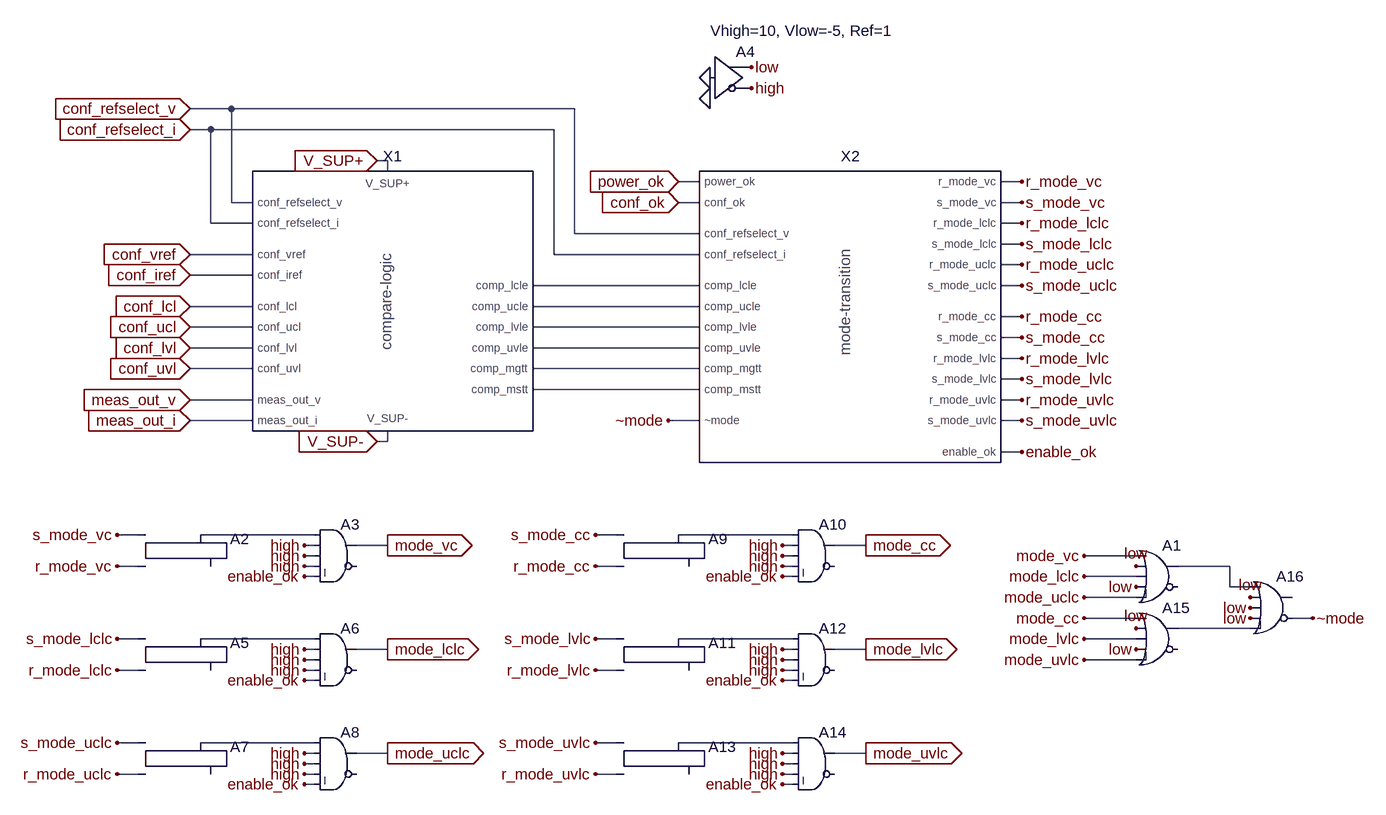
[diagram p0: schematic limit-logic.asc]
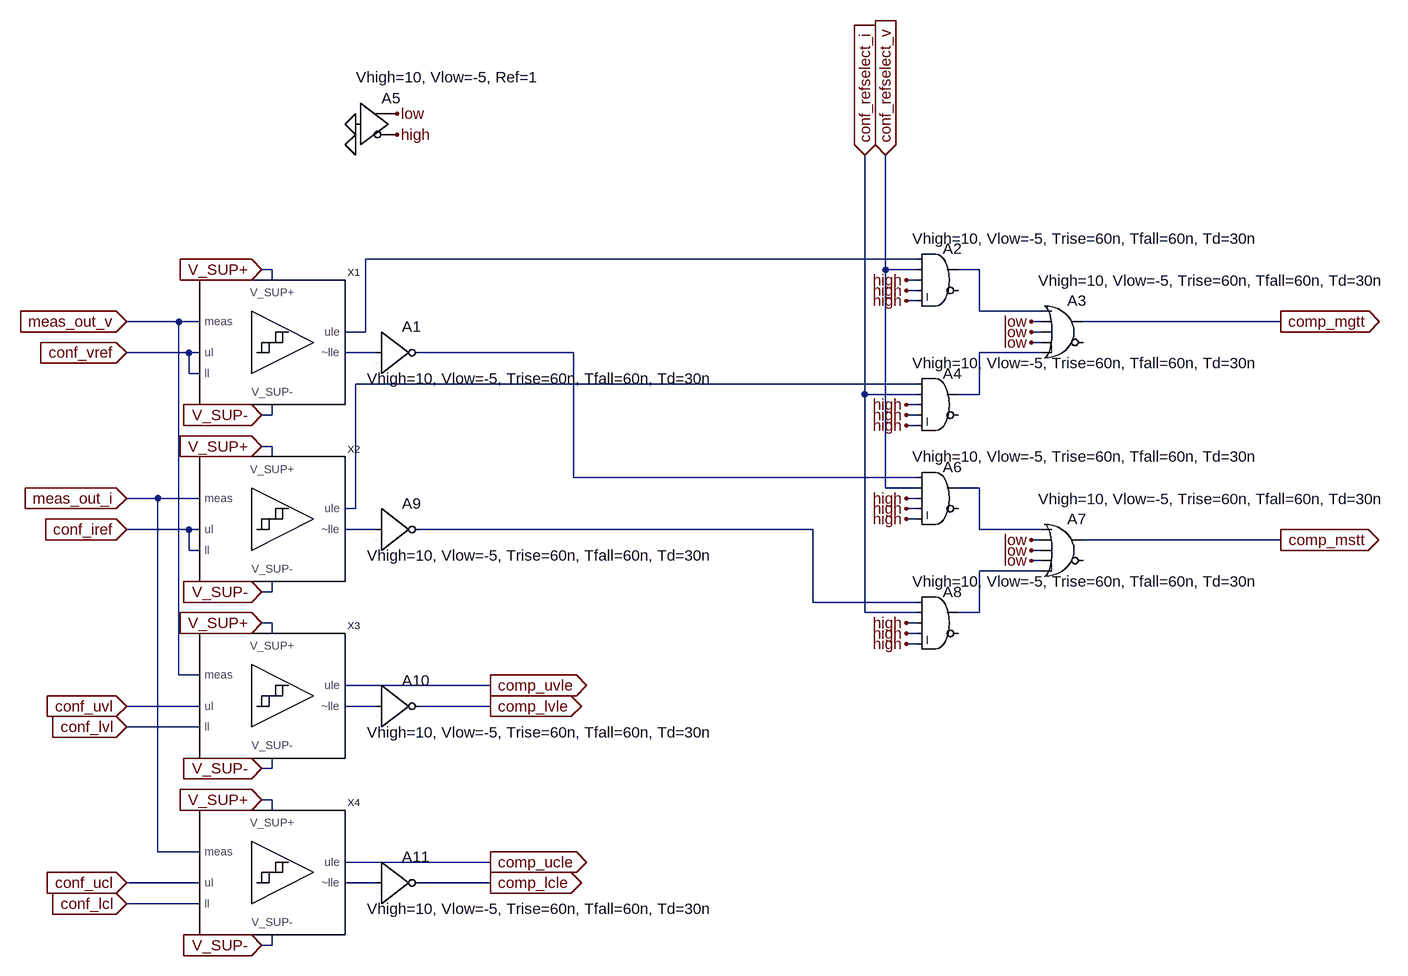
[diagram p1: sub-circuit compare-logic.asc]
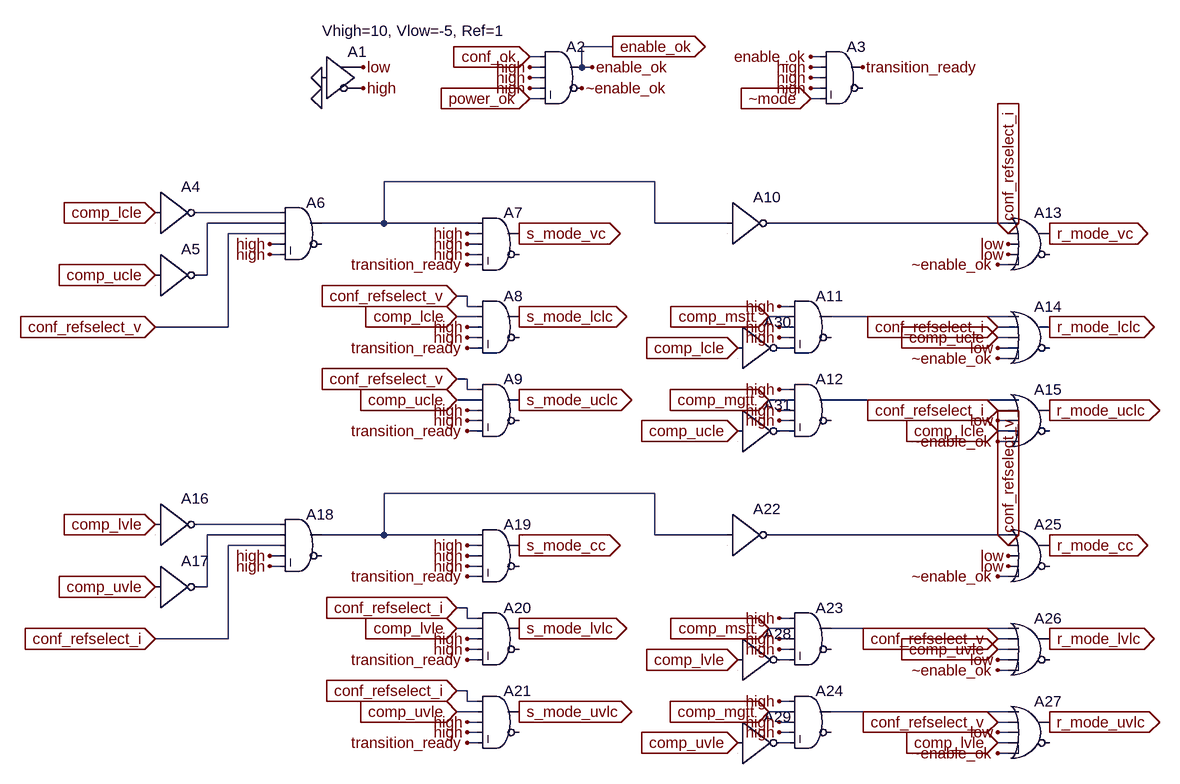
[diagram p2: sub-circuit mode-transition.asc]
limit-logic.asc, the LTspice schematic file:
Version 4
SHEET 1 2188 924
WIRE -176 -208 -240 -208
WIRE 352 -208 -176 -208
WIRE -208 -176 -240 -176
WIRE 320 -176 -208 -176
WIRE 64 -128 48 -128
WIRE 64 -112 64 -128
WIRE 544 -96 512 -96
WIRE 1040 -96 1008 -96
WIRE -176 -64 -176 -208
WIRE -144 -64 -176 -64
WIRE 544 -64 512 -64
WIRE 1040 -64 1008 -64
WIRE -208 -32 -208 -176
WIRE -144 -32 -208 -32
WIRE 1040 -32 1008 -32
WIRE 352 -16 352 -208
WIRE 544 -16 352 -16
WIRE 1040 0 1008 0
WIRE -144 16 -240 16
WIRE 320 16 320 -176
WIRE 544 16 320 16
WIRE 1040 32 1008 32
WIRE -144 48 -240 48
WIRE 544 64 288 64
WIRE 1040 64 1008 64
WIRE -144 96 -240 96
WIRE 544 96 288 96
WIRE 1040 112 1008 112
WIRE -144 128 -240 128
WIRE 544 128 288 128
WIRE 1040 144 1008 144
WIRE -144 160 -240 160
WIRE 544 160 288 160
WIRE 1040 176 1008 176
WIRE -144 192 -240 192
WIRE 544 192 288 192
WIRE 1040 208 1008 208
WIRE 544 224 288 224
WIRE -144 240 -240 240
WIRE 1040 240 1008 240
WIRE -144 272 -240 272
WIRE 544 272 496 272
WIRE 1040 272 1008 272
WIRE 64 304 64 288
WIRE 64 304 48 304
WIRE 1040 320 1008 320
WIRE -320 448 -352 448
WIRE -48 448 -224 448
WIRE 416 448 384 448
WIRE 688 448 512 448
WIRE -48 464 -64 464
WIRE 64 464 16 464
WIRE 688 464 672 464
WIRE 800 464 752 464
WIRE -48 480 -64 480
WIRE 688 480 672 480
WIRE 1216 480 1136 480
WIRE -320 496 -352 496
WIRE -48 496 -64 496
WIRE 416 496 384 496
WIRE 688 496 672 496
WIRE 1360 496 1280 496
WIRE -48 512 -64 512
WIRE 688 512 672 512
WIRE 1216 512 1136 512
WIRE 1360 528 1360 496
WIRE 1392 528 1360 528
WIRE 1216 544 1136 544
WIRE 1216 576 1136 576
WIRE 1488 576 1456 576
WIRE 1392 592 1280 592
WIRE -320 608 -352 608
WIRE -48 608 -224 608
WIRE 416 608 384 608
WIRE 688 608 512 608
WIRE 1216 608 1136 608
WIRE -48 624 -64 624
WIRE 64 624 16 624
WIRE 688 624 672 624
WIRE 800 624 752 624
WIRE -48 640 -64 640
WIRE 688 640 672 640
WIRE 1216 640 1136 640
WIRE -320 656 -352 656
WIRE -48 656 -64 656
WIRE 416 656 384 656
WIRE 688 656 672 656
WIRE -48 672 -64 672
WIRE 688 672 672 672
WIRE -320 768 -352 768
WIRE -48 768 -224 768
WIRE 416 768 384 768
WIRE 688 768 512 768
WIRE -48 784 -64 784
WIRE 64 784 16 784
WIRE 688 784 672 784
WIRE 800 784 752 784
WIRE -48 800 -64 800
WIRE 688 800 672 800
WIRE -320 816 -352 816
WIRE -48 816 -64 816
WIRE 416 816 384 816
WIRE 688 816 672 816
WIRE -48 832 -64 832
WIRE 688 832 672 832
FLAG -240 240 meas_out_v
IOPIN -240 240 In
FLAG -240 272 meas_out_i
IOPIN -240 272 In
FLAG -240 16 conf_vref
IOPIN -240 16 In
FLAG -240 48 conf_iref
IOPIN -240 48 In
FLAG -240 192 conf_uvl
IOPIN -240 192 In
FLAG -240 160 conf_lvl
IOPIN -240 160 In
FLAG -240 128 conf_ucl
IOPIN -240 128 In
FLAG -240 96 conf_lcl
IOPIN -240 96 In
FLAG -240 -208 conf_refselect_v
IOPIN -240 -208 In
FLAG -240 -176 conf_refselect_i
IOPIN -240 -176 In
FLAG 512 -64 conf_ok
IOPIN 512 -64 In
FLAG 512 -96 power_ok
IOPIN 512 -96 In
FLAG 1040 -96 r_mode_vc
FLAG 1040 -32 r_mode_lclc
FLAG 1040 32 r_mode_uclc
FLAG 1040 112 r_mode_cc
FLAG 1040 176 r_mode_lvlc
FLAG 1040 240 r_mode_uvlc
FLAG 1040 -64 s_mode_vc
FLAG 1040 0 s_mode_lclc
FLAG 1040 64 s_mode_uclc
FLAG 1040 144 s_mode_cc
FLAG 1040 208 s_mode_lvlc
FLAG 1040 272 s_mode_uvlc
FLAG -352 496 r_mode_vc
FLAG -352 656 r_mode_lclc
FLAG -352 816 r_mode_uclc
FLAG 384 496 r_mode_cc
FLAG 384 656 r_mode_lvlc
FLAG 384 816 r_mode_uvlc
FLAG -352 448 s_mode_vc
FLAG -352 608 s_mode_lclc
FLAG -352 768 s_mode_uclc
FLAG 384 448 s_mode_cc
FLAG 384 608 s_mode_lvlc
FLAG 384 768 s_mode_uvlc
FLAG 1040 320 enable_ok
FLAG 560 -224 0
FLAG 560 -256 0
FLAG 624 -240 high
FLAG 624 -272 low
FLAG -64 464 high
FLAG -64 480 high
FLAG -64 496 high
FLAG -64 512 enable_ok
FLAG 64 464 mode_vc
IOPIN 64 464 Out
FLAG -64 624 high
FLAG -64 640 high
FLAG -64 656 high
FLAG -64 672 enable_ok
FLAG 64 624 mode_lclc
IOPIN 64 624 Out
FLAG -64 784 high
FLAG -64 800 high
FLAG -64 816 high
FLAG -64 832 enable_ok
FLAG 64 784 mode_uclc
IOPIN 64 784 Out
FLAG 672 464 high
FLAG 672 480 high
FLAG 672 496 high
FLAG 672 512 enable_ok
FLAG 800 464 mode_cc
IOPIN 800 464 Out
FLAG 672 624 high
FLAG 672 640 high
FLAG 672 656 high
FLAG 672 672 enable_ok
FLAG 800 624 mode_lvlc
IOPIN 800 624 Out
FLAG 672 784 high
FLAG 672 800 high
FLAG 672 816 high
FLAG 672 832 enable_ok
FLAG 800 784 mode_uvlc
IOPIN 800 784 Out
FLAG 1136 480 mode_vc
FLAG 1136 512 mode_lclc
FLAG 1136 544 mode_uclc
FLAG 1136 576 mode_cc
FLAG 1136 608 mode_lvlc
FLAG 1136 640 mode_uvlc
FLAG 1216 496 low
FLAG 1216 528 low
FLAG 1216 592 low
FLAG 1216 624 low
FLAG 1392 544 low
FLAG 1392 560 low
FLAG 1392 576 low
FLAG 1488 576 ~mode
FLAG 496 272 ~mode
FLAG 48 -128 V_SUP+
IOPIN 48 -128 In
FLAG 48 304 V_SUP-
IOPIN 48 304 In
SYMBOL compare-logic 64 80 R0
SYMATTR InstName X1
SYMBOL mode-transition 768 80 R0
SYMATTR InstName X2
SYMBOL Digital\\or 1248 448 R0
SYMATTR SpiceLine Vhigh=10, Vlow=-5, Trise=60n, Tfall=60n, Td=30n
SYMATTR InstName A1
SYMBOL Digital\\srflop -272 400 R0
SYMATTR InstName A2
SYMATTR SpiceLine Vhigh=10, Vlow=-5, Trise=60n, Tfall=60n, Td=30n
SYMBOL Digital\\and -16 416 R0
SYMATTR SpiceLine Vhigh=10, Vlow=-5, Trise=60n, Tfall=60n, Td=30n
SYMATTR InstName A3
SYMBOL Digital\\buf 560 -320 R0
WINDOW 39 1 -8 Left 2
SYMATTR SpiceLine Vhigh=10, Vlow=-5, Ref=1
SYMATTR InstName A4
SYMBOL Digital\\srflop -272 560 R0
SYMATTR InstName A5
SYMATTR SpiceLine Vhigh=10, Vlow=-5, Trise=60n, Tfall=60n, Td=30n
SYMBOL Digital\\and -16 576 R0
SYMATTR SpiceLine Vhigh=10, Vlow=-5, Trise=60n, Tfall=60n, Td=30n
SYMATTR InstName A6
SYMBOL Digital\\srflop -272 720 R0
SYMATTR InstName A7
SYMATTR SpiceLine Vhigh=10, Vlow=-5, Trise=60n, Tfall=60n, Td=30n
SYMBOL Digital\\and -16 736 R0
SYMATTR SpiceLine Vhigh=10, Vlow=-5, Trise=60n, Tfall=60n, Td=30n
SYMATTR InstName A8
SYMBOL Digital\\srflop 464 400 R0
SYMATTR InstName A9
SYMATTR SpiceLine Vhigh=10, Vlow=-5, Trise=60n, Tfall=60n, Td=30n
SYMBOL Digital\\and 720 416 R0
SYMATTR SpiceLine Vhigh=10, Vlow=-5, Trise=60n, Tfall=60n, Td=30n
SYMATTR InstName A10
SYMBOL Digital\\srflop 464 560 R0
SYMATTR InstName A11
SYMATTR SpiceLine Vhigh=10, Vlow=-5, Trise=60n, Tfall=60n, Td=30n
SYMBOL Digital\\and 720 576 R0
SYMATTR SpiceLine Vhigh=10, Vlow=-5, Trise=60n, Tfall=60n, Td=30n
SYMATTR InstName A12
SYMBOL Digital\\srflop 464 720 R0
SYMATTR InstName A13
SYMATTR SpiceLine Vhigh=10, Vlow=-5, Trise=60n, Tfall=60n, Td=30n
SYMBOL Digital\\and 720 736 R0
SYMATTR SpiceLine Vhigh=10, Vlow=-5, Trise=60n, Tfall=60n, Td=30n
SYMATTR InstName A14
SYMBOL Digital\\or 1248 544 R0
SYMATTR SpiceLine Vhigh=10, Vlow=-5, Trise=60n, Tfall=60n, Td=30n
SYMATTR InstName A15
SYMBOL Digital\\or 1424 496 R0
SYMATTR SpiceLine Vhigh=10, Vlow=-5, Trise=60n, Tfall=60n, Td=30n
SYMATTR InstName A16

compare-logic.asc, the sub-circuit schematic file:
Version 4
SHEET 1 1856 856
WIRE 960 -272 112 -272
WIRE -32 -256 -48 -256
WIRE 912 -256 912 -432
WIRE 960 -256 912 -256
WIRE 1056 -256 1024 -256
WIRE -32 -240 -32 -256
WIRE 960 -240 944 -240
WIRE 960 -224 944 -224
WIRE 960 -208 944 -208
WIRE 1056 -192 1056 -256
WIRE 1152 -192 1056 -192
WIRE -176 -176 -256 -176
WIRE -144 -176 -176 -176
WIRE 1152 -176 1136 -176
WIRE 1520 -176 1216 -176
WIRE 112 -160 112 -272
WIRE 112 -160 80 -160
WIRE 1152 -160 1136 -160
WIRE 1152 -144 1136 -144
WIRE -160 -128 -256 -128
WIRE -144 -128 -160 -128
WIRE 128 -128 80 -128
WIRE 432 -128 192 -128
WIRE 1152 -128 1056 -128
WIRE -160 -96 -160 -128
WIRE -144 -96 -160 -96
WIRE 960 -80 96 -80
WIRE 880 -64 880 -432
WIRE 960 -64 880 -64
WIRE 1056 -64 1056 -128
WIRE 1056 -64 1024 -64
WIRE 960 -48 944 -48
WIRE -32 -32 -32 -48
WIRE -32 -32 -48 -32
WIRE 960 -32 944 -32
WIRE 960 -16 944 -16
WIRE -32 16 -48 16
WIRE -32 32 -32 16
WIRE 432 64 432 -128
WIRE 960 64 432 64
WIRE 912 80 912 -256
WIRE 960 80 912 80
WIRE 1056 80 1024 80
WIRE -208 96 -256 96
WIRE -144 96 -208 96
WIRE 960 96 944 96
WIRE 96 112 96 -80
WIRE 96 112 80 112
WIRE 960 112 944 112
WIRE 960 128 944 128
WIRE -160 144 -256 144
WIRE -144 144 -160 144
WIRE 128 144 80 144
WIRE 800 144 192 144
WIRE 1056 144 1056 80
WIRE 1152 144 1056 144
WIRE 1152 160 1136 160
WIRE 1520 160 1216 160
WIRE -160 176 -160 144
WIRE -144 176 -160 176
WIRE 1152 176 1136 176
WIRE 1152 192 1136 192
WIRE 1152 208 1056 208
WIRE -32 240 -32 224
WIRE -32 240 -48 240
WIRE 800 256 800 144
WIRE 960 256 800 256
WIRE 880 272 880 -64
WIRE 960 272 880 272
WIRE 1056 272 1056 208
WIRE 1056 272 1024 272
WIRE -32 288 -48 288
WIRE 960 288 944 288
WIRE -32 304 -32 288
WIRE 960 304 944 304
WIRE 960 320 944 320
WIRE -176 368 -176 -176
WIRE -144 368 -176 368
WIRE 304 384 80 384
WIRE -144 416 -256 416
WIRE 128 416 80 416
WIRE 304 416 192 416
WIRE -144 448 -256 448
WIRE -32 512 -32 496
WIRE -32 512 -48 512
WIRE -32 560 -48 560
WIRE -32 576 -32 560
WIRE -208 640 -208 96
WIRE -144 640 -208 640
WIRE 304 656 80 656
WIRE -144 688 -256 688
WIRE 128 688 80 688
WIRE 304 688 192 688
WIRE -144 720 -256 720
WIRE -32 784 -32 768
WIRE -32 784 -48 784
FLAG 96 -448 0
FLAG 96 -480 0
FLAG 160 -464 high
FLAG 160 -496 low
FLAG 944 -240 high
FLAG 944 -224 high
FLAG 944 -208 high
FLAG 1136 -160 low
FLAG 1136 -144 low
FLAG 1136 -176 low
FLAG 944 -48 high
FLAG 944 -32 high
FLAG 944 -16 high
FLAG 912 -432 conf_refselect_v
IOPIN 912 -432 In
FLAG 880 -432 conf_refselect_i
IOPIN 880 -432 In
FLAG 944 96 high
FLAG 944 112 high
FLAG 944 128 high
FLAG 1136 176 low
FLAG 1136 192 low
FLAG 1136 160 low
FLAG 944 288 high
FLAG 944 304 high
FLAG 944 320 high
FLAG -48 -256 V_SUP+
IOPIN -48 -256 In
FLAG -48 -32 V_SUP-
IOPIN -48 -32 In
FLAG -48 16 V_SUP+
IOPIN -48 16 In
FLAG -48 240 V_SUP-
IOPIN -48 240 In
FLAG -48 288 V_SUP+
IOPIN -48 288 In
FLAG -48 512 V_SUP-
IOPIN -48 512 In
FLAG -48 560 V_SUP+
IOPIN -48 560 In
FLAG -48 784 V_SUP-
IOPIN -48 784 In
FLAG 1520 -176 comp_mgtt
IOPIN 1520 -176 Out
FLAG 1520 160 comp_mstt
IOPIN 1520 160 Out
FLAG 304 384 comp_uvle
IOPIN 304 384 Out
FLAG 304 416 comp_lvle
IOPIN 304 416 Out
FLAG 304 656 comp_ucle
IOPIN 304 656 Out
FLAG 304 688 comp_lcle
IOPIN 304 688 Out
FLAG -256 -176 meas_out_v
IOPIN -256 -176 In
FLAG -256 96 meas_out_i
IOPIN -256 96 In
FLAG -256 -128 conf_vref
IOPIN -256 -128 In
FLAG -256 144 conf_iref
IOPIN -256 144 In
FLAG -256 416 conf_uvl
IOPIN -256 416 In
FLAG -256 448 conf_lvl
IOPIN -256 448 In
FLAG -256 688 conf_ucl
IOPIN -256 688 In
FLAG -256 720 conf_lcl
IOPIN -256 720 In
SYMBOL window-comparator -32 -144 R0
SYMATTR InstName X1
SYMBOL Digital\\inv 128 -192 R0
WINDOW 39 -14 104 Left 2
SYMATTR InstName A1
SYMATTR SpiceLine Vhigh=10, Vlow=-5, Trise=60n, Tfall=60n, Td=30n
SYMBOL Digital\\and 992 -304 R0
WINDOW 39 -39 0 Left 2
SYMATTR InstName A2
SYMATTR SpiceLine Vhigh=10, Vlow=-5, Trise=60n, Tfall=60n, Td=30n
SYMBOL Digital\\or 1184 -224 R0
WINDOW 39 -37 -15 Left 2
SYMATTR InstName A3
SYMATTR SpiceLine Vhigh=10, Vlow=-5, Trise=60n, Tfall=60n, Td=30n
SYMBOL Digital\\buf 96 -544 R0
WINDOW 39 1 -8 Left 2
SYMATTR InstName A5
SYMATTR SpiceLine Vhigh=10, Vlow=-5, Ref=1
SYMBOL Digital\\and 992 -112 R0
WINDOW 39 -39 0 Left 2
SYMATTR InstName A4
SYMATTR SpiceLine Vhigh=10, Vlow=-5, Trise=60n, Tfall=60n, Td=30n
SYMBOL Digital\\and 992 32 R0
WINDOW 39 -39 0 Left 2
SYMATTR InstName A6
SYMATTR SpiceLine Vhigh=10, Vlow=-5, Trise=60n, Tfall=60n, Td=30n
SYMBOL Digital\\or 1184 112 R0
WINDOW 39 -37 -15 Left 2
SYMATTR InstName A7
SYMATTR SpiceLine Vhigh=10, Vlow=-5, Trise=60n, Tfall=60n, Td=30n
SYMBOL Digital\\and 992 224 R0
WINDOW 39 -39 0 Left 2
SYMATTR InstName A8
SYMATTR SpiceLine Vhigh=10, Vlow=-5, Trise=60n, Tfall=60n, Td=30n
SYMBOL window-comparator -32 128 R0
SYMATTR InstName X2
SYMBOL Digital\\inv 128 80 R0
WINDOW 39 -14 104 Left 2
SYMATTR InstName A9
SYMATTR SpiceLine Vhigh=10, Vlow=-5, Trise=60n, Tfall=60n, Td=30n
SYMBOL window-comparator -32 400 R0
SYMATTR InstName X3
SYMBOL Digital\\inv 128 352 R0
WINDOW 39 -14 104 Left 2
SYMATTR InstName A10
SYMATTR SpiceLine Vhigh=10, Vlow=-5, Trise=60n, Tfall=60n, Td=30n
SYMBOL window-comparator -32 672 R0
SYMATTR InstName X4
SYMBOL Digital\\inv 128 624 R0
WINDOW 39 -14 104 Left 2
SYMATTR InstName A11
SYMATTR SpiceLine Vhigh=10, Vlow=-5, Trise=60n, Tfall=60n, Td=30n

mode-transition.asc, the sub-circuit schematic file:
Version 4
SHEET 1 2020 1448
WIRE 688 144 640 144
WIRE 576 160 560 160
WIRE 1008 160 992 160
WIRE 576 176 560 176
WIRE 640 176 640 144
WIRE 656 176 640 176
WIRE 1008 176 992 176
WIRE 576 192 560 192
WIRE 1008 192 992 192
WIRE 576 208 560 208
WIRE 1008 208 992 208
WIRE 576 224 560 224
WIRE 1008 224 992 224
WIRE 752 352 336 352
WIRE 176 400 48 400
WIRE 176 416 64 416
WIRE 336 416 336 352
WIRE 336 416 240 416
WIRE 480 416 336 416
WIRE 752 416 752 352
WIRE 864 416 752 416
WIRE 1296 416 928 416
WIRE 176 432 96 432
WIRE 480 432 464 432
WIRE 176 448 160 448
WIRE 480 448 464 448
WIRE 176 464 160 464
WIRE 480 464 464 464
WIRE 480 480 464 480
WIRE 1296 480 1280 480
WIRE 64 496 64 416
WIRE 64 496 48 496
WIRE 464 528 448 528
WIRE 464 544 464 528
WIRE 480 544 464 544
WIRE 960 544 944 544
WIRE 480 560 448 560
WIRE 960 560 928 560
WIRE 1296 560 1024 560
WIRE 96 576 96 432
WIRE 96 576 -16 576
WIRE 480 576 464 576
WIRE 960 576 944 576
WIRE 1296 576 1280 576
WIRE 480 592 464 592
WIRE 960 592 944 592
WIRE 1296 592 1280 592
WIRE 480 608 464 608
WIRE 960 608 944 608
WIRE 1296 608 1280 608
WIRE 1296 624 1280 624
WIRE 464 656 448 656
WIRE 464 672 464 656
WIRE 480 672 464 672
WIRE 960 672 944 672
WIRE 480 688 448 688
WIRE 960 688 928 688
WIRE 1296 688 1024 688
WIRE 480 704 464 704
WIRE 960 704 944 704
WIRE 1296 704 1280 704
WIRE 480 720 464 720
WIRE 960 720 944 720
WIRE 1296 720 1280 720
WIRE 480 736 464 736
WIRE 960 736 944 736
WIRE 1296 736 1280 736
WIRE 1296 752 1280 752
WIRE 752 832 336 832
WIRE 176 880 48 880
WIRE 176 896 64 896
WIRE 336 896 336 832
WIRE 336 896 240 896
WIRE 480 896 336 896
WIRE 752 896 752 832
WIRE 864 896 752 896
WIRE 1296 896 928 896
WIRE 176 912 96 912
WIRE 480 912 464 912
WIRE 176 928 160 928
WIRE 480 928 464 928
WIRE 176 944 160 944
WIRE 480 944 464 944
WIRE 480 960 464 960
WIRE 1296 960 1280 960
WIRE 64 976 64 896
WIRE 64 976 48 976
WIRE 464 1008 448 1008
WIRE 464 1024 464 1008
WIRE 480 1024 464 1024
WIRE 960 1024 944 1024
WIRE 480 1040 448 1040
WIRE 960 1040 928 1040
WIRE 1296 1040 1024 1040
WIRE 96 1056 96 912
WIRE 96 1056 -16 1056
WIRE 480 1056 464 1056
WIRE 960 1056 944 1056
WIRE 1296 1056 1280 1056
WIRE 480 1072 464 1072
WIRE 960 1072 944 1072
WIRE 1296 1072 1280 1072
WIRE 480 1088 464 1088
WIRE 960 1088 944 1088
WIRE 1296 1088 1280 1088
WIRE 1296 1104 1280 1104
WIRE 464 1136 448 1136
WIRE 464 1152 464 1136
WIRE 480 1152 464 1152
WIRE 960 1152 944 1152
WIRE 480 1168 448 1168
WIRE 960 1168 928 1168
WIRE 1296 1168 1024 1168
WIRE 480 1184 464 1184
WIRE 960 1184 944 1184
WIRE 1296 1184 1280 1184
WIRE 480 1200 464 1200
WIRE 960 1200 944 1200
WIRE 1296 1200 1280 1200
WIRE 480 1216 464 1216
WIRE 960 1216 944 1216
WIRE 1296 1216 1280 1216
WIRE 1296 1232 1280 1232
FLAG 240 224 0
FLAG 240 192 0
FLAG 304 208 high
FLAG 304 176 low
FLAG -16 400 comp_lcle
IOPIN -16 400 In
FLAG -16 496 comp_ucle
IOPIN -16 496 In
FLAG -16 576 conf_refselect_v
IOPIN -16 576 In
FLAG 160 448 high
FLAG 160 464 high
FLAG 464 480 transition_ready
FLAG 464 432 high
FLAG 464 448 high
FLAG 464 464 high
FLAG 464 608 transition_ready
FLAG 464 576 high
FLAG 464 592 high
FLAG 464 736 transition_ready
FLAG 464 704 high
FLAG 464 720 high
FLAG 448 528 conf_refselect_v
IOPIN 448 528 In
FLAG 448 656 conf_refselect_v
IOPIN 448 656 In
FLAG 448 560 comp_lcle
IOPIN 448 560 In
FLAG 448 688 comp_ucle
IOPIN 448 688 In
FLAG 544 432 s_mode_vc
IOPIN 544 432 Out
FLAG 544 560 s_mode_lclc
IOPIN 544 560 Out
FLAG 544 688 s_mode_uclc
IOPIN 544 688 Out
FLAG 928 560 comp_mstt
IOPIN 928 560 In
FLAG 928 688 comp_mgtt
IOPIN 928 688 In
FLAG 944 576 high
FLAG 944 592 high
FLAG 944 704 high
FLAG 944 720 high
FLAG 1280 480 ~enable_ok
FLAG 1280 624 ~enable_ok
FLAG 1280 752 ~enable_ok
FLAG 1296 448 low
FLAG 1296 464 low
FLAG 1280 576 conf_refselect_i
IOPIN 1280 576 In
FLAG 1280 608 low
FLAG 1280 720 low
FLAG 1280 704 conf_refselect_i
IOPIN 1280 704 In
FLAG 1360 432 r_mode_vc
IOPIN 1360 432 Out
FLAG 1360 576 r_mode_lclc
IOPIN 1360 576 Out
FLAG 1360 704 r_mode_uclc
IOPIN 1360 704 Out
FLAG -16 880 comp_lvle
IOPIN -16 880 In
FLAG -16 976 comp_uvle
IOPIN -16 976 In
FLAG -16 1056 conf_refselect_i
IOPIN -16 1056 In
FLAG 160 928 high
FLAG 160 944 high
FLAG 464 960 transition_ready
FLAG 464 912 high
FLAG 464 928 high
FLAG 464 944 high
FLAG 464 1088 transition_ready
FLAG 464 1056 high
FLAG 464 1072 high
FLAG 464 1216 transition_ready
FLAG 464 1184 high
FLAG 464 1200 high
FLAG 448 1008 conf_refselect_i
IOPIN 448 1008 In
FLAG 448 1136 conf_refselect_i
IOPIN 448 1136 In
FLAG 448 1040 comp_lvle
IOPIN 448 1040 In
FLAG 448 1168 comp_uvle
IOPIN 448 1168 In
FLAG 544 912 s_mode_cc
IOPIN 544 912 Out
FLAG 544 1040 s_mode_lvlc
IOPIN 544 1040 Out
FLAG 544 1168 s_mode_uvlc
IOPIN 544 1168 Out
FLAG 928 1040 comp_mstt
IOPIN 928 1040 In
FLAG 928 1168 comp_mgtt
IOPIN 928 1168 In
FLAG 944 1056 high
FLAG 944 1072 high
FLAG 944 1184 high
FLAG 944 1200 high
FLAG 1280 960 ~enable_ok
FLAG 1280 1104 ~enable_ok
FLAG 1280 1232 ~enable_ok
FLAG 1296 928 low
FLAG 1296 944 low
FLAG 1280 1056 conf_refselect_v
IOPIN 1280 1056 In
FLAG 1280 1088 low
FLAG 1280 1200 low
FLAG 1280 1184 conf_refselect_v
IOPIN 1280 1184 In
FLAG 1360 912 r_mode_cc
IOPIN 1360 912 Out
FLAG 1360 1056 r_mode_lvlc
IOPIN 1360 1056 Out
FLAG 1360 1184 r_mode_uvlc
IOPIN 1360 1184 Out
FLAG 560 160 conf_ok
IOPIN 560 160 In
FLAG 560 224 power_ok
IOPIN 560 224 In
FLAG 560 176 high
FLAG 560 192 high
FLAG 560 208 high
FLAG 656 176 enable_ok
FLAG 640 208 ~enable_ok
FLAG 992 160 enable_ok
FLAG 992 224 ~mode
IOPIN 992 224 In
FLAG 992 176 high
FLAG 992 192 high
FLAG 992 208 high
FLAG 1072 176 transition_ready
FLAG 688 144 enable_ok
IOPIN 688 144 Out
FLAG 1296 432 conf_refselect_i
IOPIN 1296 432 In
FLAG 1296 912 conf_refselect_v
IOPIN 1296 912 In
FLAG 1280 592 comp_ucle
IOPIN 1280 592 In
FLAG 1280 736 comp_lcle
IOPIN 1280 736 In
FLAG 1280 1072 comp_uvle
IOPIN 1280 1072 In
FLAG 1280 1216 comp_lvle
IOPIN 1280 1216 In
FLAG 880 1088 comp_lvle
IOPIN 880 1088 In
FLAG 880 1216 comp_uvle
IOPIN 880 1216 In
FLAG 880 608 comp_lcle
IOPIN 880 608 In
FLAG 880 736 comp_ucle
IOPIN 880 736 In
FLAG 944 544 high
FLAG 944 672 high
FLAG 944 1024 high
FLAG 944 1152 high
SYMBOL Digital\\buf 240 128 R0
WINDOW 39 1 -8 Left 2
SYMATTR SpiceLine Vhigh=10, Vlow=-5, Ref=1
SYMATTR InstName A1
SYMBOL Digital\\and 608 128 R0
SYMATTR SpiceLine Vhigh=10, Vlow=-5, Trise=60n, Tfall=60n, Td=30n
SYMATTR InstName A2
SYMBOL Digital\\inv -16 336 R0
SYMATTR SpiceLine Vhigh=10, Vlow=-5, Trise=60n, Tfall=60n, Td=30n
SYMATTR InstName A4
SYMBOL Digital\\inv -16 432 R0
SYMATTR SpiceLine Vhigh=10, Vlow=-5, Trise=60n, Tfall=60n, Td=30n
SYMATTR InstName A5
SYMBOL Digital\\and 208 368 R0
SYMATTR SpiceLine Vhigh=10, Vlow=-5, Trise=60n, Tfall=60n, Td=30n
SYMATTR InstName A6
SYMBOL Digital\\and 512 384 R0
SYMATTR SpiceLine Vhigh=10, Vlow=-5, Trise=60n, Tfall=60n, Td=30n
SYMATTR InstName A7
SYMBOL Digital\\and 512 512 R0
SYMATTR SpiceLine Vhigh=10, Vlow=-5, Trise=60n, Tfall=60n, Td=30n
SYMATTR InstName A8
SYMBOL Digital\\and 512 640 R0
SYMATTR SpiceLine Vhigh=10, Vlow=-5, Trise=60n, Tfall=60n, Td=30n
SYMATTR InstName A9
SYMBOL Digital\\inv 864 352 R0
SYMATTR SpiceLine Vhigh=10, Vlow=-5, Trise=60n, Tfall=60n, Td=30n
SYMATTR InstName A10
SYMBOL Digital\\and 992 512 R0
SYMATTR SpiceLine Vhigh=10, Vlow=-5, Trise=60n, Tfall=60n, Td=30n
SYMATTR InstName A11
SYMBOL Digital\\and 992 640 R0
SYMATTR SpiceLine Vhigh=10, Vlow=-5, Trise=60n, Tfall=60n, Td=30n
SYMATTR InstName A12
SYMBOL Digital\\or 1328 384 R0
SYMATTR SpiceLine Vhigh=10, Vlow=-5, Trise=60n, Tfall=60n, Td=30n
SYMATTR InstName A13
SYMBOL Digital\\or 1328 528 R0
SYMATTR SpiceLine Vhigh=10, Vlow=-5, Trise=60n, Tfall=60n, Td=30n
SYMATTR InstName A14
SYMBOL Digital\\or 1328 656 R0
SYMATTR SpiceLine Vhigh=10, Vlow=-5, Trise=60n, Tfall=60n, Td=30n
SYMATTR InstName A15
SYMBOL Digital\\inv -16 816 R0
SYMATTR SpiceLine Vhigh=10, Vlow=-5, Trise=60n, Tfall=60n, Td=30n
SYMATTR InstName A16
SYMBOL Digital\\inv -16 912 R0
SYMATTR SpiceLine Vhigh=10, Vlow=-5, Trise=60n, Tfall=60n, Td=30n
SYMATTR InstName A17
SYMBOL Digital\\and 208 848 R0
SYMATTR SpiceLine Vhigh=10, Vlow=-5, Trise=60n, Tfall=60n, Td=30n
SYMATTR InstName A18
SYMBOL Digital\\and 512 864 R0
SYMATTR SpiceLine Vhigh=10, Vlow=-5, Trise=60n, Tfall=60n, Td=30n
SYMATTR InstName A19
SYMBOL Digital\\and 512 992 R0
SYMATTR SpiceLine Vhigh=10, Vlow=-5, Trise=60n, Tfall=60n, Td=30n
SYMATTR InstName A20
SYMBOL Digital\\and 512 1120 R0
SYMATTR SpiceLine Vhigh=10, Vlow=-5, Trise=60n, Tfall=60n, Td=30n
SYMATTR InstName A21
SYMBOL Digital\\inv 864 832 R0
SYMATTR SpiceLine Vhigh=10, Vlow=-5, Trise=60n, Tfall=60n, Td=30n
SYMATTR InstName A22
SYMBOL Digital\\and 992 992 R0
SYMATTR SpiceLine Vhigh=10, Vlow=-5, Trise=60n, Tfall=60n, Td=30n
SYMATTR InstName A23
SYMBOL Digital\\and 992 1120 R0
SYMATTR SpiceLine Vhigh=10, Vlow=-5, Trise=60n, Tfall=60n, Td=30n
SYMATTR InstName A24
SYMBOL Digital\\or 1328 864 R0
SYMATTR SpiceLine Vhigh=10, Vlow=-5, Trise=60n, Tfall=60n, Td=30n
SYMATTR InstName A25
SYMBOL Digital\\or 1328 1008 R0
SYMATTR SpiceLine Vhigh=10, Vlow=-5, Trise=60n, Tfall=60n, Td=30n
SYMATTR InstName A26
SYMBOL Digital\\or 1328 1136 R0
SYMATTR SpiceLine Vhigh=10, Vlow=-5, Trise=60n, Tfall=60n, Td=30n
SYMATTR InstName A27
SYMBOL Digital\\and 1040 128 R0
SYMATTR SpiceLine Vhigh=10, Vlow=-5, Trise=60n, Tfall=60n, Td=30n
SYMATTR InstName A3
SYMBOL Digital\\inv 880 1024 R0
SYMATTR SpiceLine Vhigh=10, Vlow=-5, Trise=60n, Tfall=60n, Td=30n
SYMATTR InstName A28
SYMBOL Digital\\inv 880 1152 R0
SYMATTR SpiceLine Vhigh=10, Vlow=-5, Trise=60n, Tfall=60n, Td=30n
SYMATTR InstName A29
SYMBOL Digital\\inv 880 544 R0
SYMATTR SpiceLine Vhigh=10, Vlow=-5, Trise=60n, Tfall=60n, Td=30n
SYMATTR InstName A30
SYMBOL Digital\\inv 880 672 R0
SYMATTR SpiceLine Vhigh=10, Vlow=-5, Trise=60n, Tfall=60n, Td=30n
SYMATTR InstName A31

The netlist it stands for:
* limit-logic.asc
XX1 conf_iref conf_lcl conf_lvl conf_refselect_i conf_refselect_v conf_ucl conf_uvl conf_vref meas_out_i meas_out_v V_SUP+ V_SUP- N001 N003 N005 N006 N002 N004 compare-logic
XX2 N001 N003 N005 N006 N002 N004 conf_ok conf_refselect_i conf_refselect_v power_ok ~mode r_mode_cc r_mode_lclc r_mode_lvlc r_mode_uclc r_mode_uvlc r_mode_vc s_mode_cc s_mode_lclc s_mode_lvlc s_mode_uclc s_mode_uvlc s_mode_vc enable_ok mode-transition
A1 mode_vc low mode_lclc low mode_uclc 0 N009 0 OR Vhigh=10, Vlow=-5, Trise=60n, Tfall=60n, Td=30n
A2 s_mode_vc r_mode_vc 0 0 0 0 N007 0 SRFLOP Vhigh=10, Vlow=-5, Trise=60n, Tfall=60n, Td=30n
A3 N007 high high high enable_ok 0 mode_vc 0 AND Vhigh=10, Vlow=-5, Trise=60n, Tfall=60n, Td=30n
A4 0 0 0 0 0 high low 0 BUF Vhigh=10, Vlow=-5, Ref=1
A5 s_mode_lclc r_mode_lclc 0 0 0 0 N011 0 SRFLOP Vhigh=10, Vlow=-5, Trise=60n, Tfall=60n, Td=30n
A6 N011 high high high enable_ok 0 mode_lclc 0 AND Vhigh=10, Vlow=-5, Trise=60n, Tfall=60n, Td=30n
A7 s_mode_uclc r_mode_uclc 0 0 0 0 N013 0 SRFLOP Vhigh=10, Vlow=-5, Trise=60n, Tfall=60n, Td=30n
A8 N013 high high high enable_ok 0 mode_uclc 0 AND Vhigh=10, Vlow=-5, Trise=60n, Tfall=60n, Td=30n
A9 s_mode_cc r_mode_cc 0 0 0 0 N008 0 SRFLOP Vhigh=10, Vlow=-5, Trise=60n, Tfall=60n, Td=30n
A10 N008 high high high enable_ok 0 mode_cc 0 AND Vhigh=10, Vlow=-5, Trise=60n, Tfall=60n, Td=30n
A11 s_mode_lvlc r_mode_lvlc 0 0 0 0 N012 0 SRFLOP Vhigh=10, Vlow=-5, Trise=60n, Tfall=60n, Td=30n
A12 N012 high high high enable_ok 0 mode_lvlc 0 AND Vhigh=10, Vlow=-5, Trise=60n, Tfall=60n, Td=30n
A13 s_mode_uvlc r_mode_uvlc 0 0 0 0 N014 0 SRFLOP Vhigh=10, Vlow=-5, Trise=60n, Tfall=60n, Td=30n
A14 N014 high high high enable_ok 0 mode_uvlc 0 AND Vhigh=10, Vlow=-5, Trise=60n, Tfall=60n, Td=30n
A15 mode_cc low mode_lvlc low mode_uvlc 0 N010 0 OR Vhigh=10, Vlow=-5, Trise=60n, Tfall=60n, Td=30n
A16 N009 low low low N010 ~mode 0 0 OR Vhigh=10, Vlow=-5, Trise=60n, Tfall=60n, Td=30n

* block symbol definitions
.subckt compare-logic conf_iref conf_lcl conf_lvl conf_refselect_i conf_refselect_v conf_ucl conf_uvl conf_vref meas_out_i meas_out_v V_SUP+ V_SUP- comp_lcle comp_lvle comp_mgtt comp_mstt comp_ucle comp_uvle
XX1 V_SUP+ V_SUP- conf_vref conf_vref meas_out_v N001 N003 window-comparator  ; pins V_SUP+ V_SUP- ul ll meas ule ~lle
A1 N003 0 0 0 0 N004 0 0 BUF Vhigh=10, Vlow=-5, Trise=60n, Tfall=60n, Td=30n
A2 N001 conf_refselect_v high high high 0 N002 0 AND Vhigh=10, Vlow=-5, Trise=60n, Tfall=60n, Td=30n
A3 N002 low low low N005 0 comp_mgtt 0 OR Vhigh=10, Vlow=-5, Trise=60n, Tfall=60n, Td=30n
A5 0 0 0 0 0 high low 0 BUF Vhigh=10, Vlow=-5, Ref=1
A4 N006 conf_refselect_i high high high 0 N005 0 AND Vhigh=10, Vlow=-5, Trise=60n, Tfall=60n, Td=30n
A6 N004 conf_refselect_v high high high 0 N007 0 AND Vhigh=10, Vlow=-5, Trise=60n, Tfall=60n, Td=30n
A7 N007 low low low N010 0 comp_mstt 0 OR Vhigh=10, Vlow=-5, Trise=60n, Tfall=60n, Td=30n
A8 N009 conf_refselect_i high high high 0 N010 0 AND Vhigh=10, Vlow=-5, Trise=60n, Tfall=60n, Td=30n
XX2 V_SUP+ V_SUP- conf_iref conf_iref meas_out_i N006 N008 window-comparator  ; pins V_SUP+ V_SUP- ul ll meas ule ~lle
A9 N008 0 0 0 0 N009 0 0 BUF Vhigh=10, Vlow=-5, Trise=60n, Tfall=60n, Td=30n
XX3 V_SUP+ V_SUP- conf_uvl conf_lvl meas_out_v comp_uvle N011 window-comparator  ; pins V_SUP+ V_SUP- ul ll meas ule ~lle
A10 N011 0 0 0 0 comp_lvle 0 0 BUF Vhigh=10, Vlow=-5, Trise=60n, Tfall=60n, Td=30n
XX4 V_SUP+ V_SUP- conf_ucl conf_lcl meas_out_i comp_ucle N012 window-comparator  ; pins V_SUP+ V_SUP- ul ll meas ule ~lle
A11 N012 0 0 0 0 comp_lcle 0 0 BUF Vhigh=10, Vlow=-5, Trise=60n, Tfall=60n, Td=30n
.ends compare-logic

.subckt mode-transition comp_lcle comp_lvle comp_mgtt comp_mstt comp_ucle comp_uvle conf_ok conf_refselect_i conf_refselect_v power_ok ~mode r_mode_cc r_mode_lclc r_mode_lvlc r_mode_uclc r_mode_uvlc r_mode_vc s_mode_cc s_mode_lclc s_mode_lvlc s_mode_uclc s_mode_uvlc s_mode_vc enable_ok
A1 0 0 0 0 0 high low 0 BUF Vhigh=10, Vlow=-5, Ref=1
A2 conf_ok high high high power_ok ~enable_ok enable_ok 0 AND Vhigh=10, Vlow=-5, Trise=60n, Tfall=60n, Td=30n
A4 comp_lcle 0 0 0 0 N002 0 0 BUF Vhigh=10, Vlow=-5, Trise=60n, Tfall=60n, Td=30n
A5 comp_ucle 0 0 0 0 N003 0 0 BUF Vhigh=10, Vlow=-5, Trise=60n, Tfall=60n, Td=30n
A6 N002 N003 conf_refselect_v high high 0 N001 0 AND Vhigh=10, Vlow=-5, Trise=60n, Tfall=60n, Td=30n
A7 N001 high high high transition_ready 0 s_mode_vc 0 AND Vhigh=10, Vlow=-5, Trise=60n, Tfall=60n, Td=30n
A8 conf_refselect_v comp_lcle high high transition_ready 0 s_mode_lclc 0 AND Vhigh=10, Vlow=-5, Trise=60n, Tfall=60n, Td=30n
A9 conf_refselect_v comp_ucle high high transition_ready 0 s_mode_uclc 0 AND Vhigh=10, Vlow=-5, Trise=60n, Tfall=60n, Td=30n
A10 N001 0 0 0 0 N004 0 0 BUF Vhigh=10, Vlow=-5, Trise=60n, Tfall=60n, Td=30n
A11 high comp_mstt high high N006 0 N005 0 AND Vhigh=10, Vlow=-5, Trise=60n, Tfall=60n, Td=30n
A12 high comp_mgtt high high N008 0 N007 0 AND Vhigh=10, Vlow=-5, Trise=60n, Tfall=60n, Td=30n
A13 N004 conf_refselect_i low low ~enable_ok 0 r_mode_vc 0 OR Vhigh=10, Vlow=-5, Trise=60n, Tfall=60n, Td=30n
A14 N005 conf_refselect_i comp_ucle low ~enable_ok 0 r_mode_lclc 0 OR Vhigh=10, Vlow=-5, Trise=60n, Tfall=60n, Td=30n
A15 N007 conf_refselect_i low comp_lcle ~enable_ok 0 r_mode_uclc 0 OR Vhigh=10, Vlow=-5, Trise=60n, Tfall=60n, Td=30n
A16 comp_lvle 0 0 0 0 N010 0 0 BUF Vhigh=10, Vlow=-5, Trise=60n, Tfall=60n, Td=30n
A17 comp_uvle 0 0 0 0 N011 0 0 BUF Vhigh=10, Vlow=-5, Trise=60n, Tfall=60n, Td=30n
A18 N010 N011 conf_refselect_i high high 0 N009 0 AND Vhigh=10, Vlow=-5, Trise=60n, Tfall=60n, Td=30n
A19 N009 high high high transition_ready 0 s_mode_cc 0 AND Vhigh=10, Vlow=-5, Trise=60n, Tfall=60n, Td=30n
A20 conf_refselect_i comp_lvle high high transition_ready 0 s_mode_lvlc 0 AND Vhigh=10, Vlow=-5, Trise=60n, Tfall=60n, Td=30n
A21 conf_refselect_i comp_uvle high high transition_ready 0 s_mode_uvlc 0 AND Vhigh=10, Vlow=-5, Trise=60n, Tfall=60n, Td=30n
A22 N009 0 0 0 0 N012 0 0 BUF Vhigh=10, Vlow=-5, Trise=60n, Tfall=60n, Td=30n
A23 high comp_mstt high high N014 0 N013 0 AND Vhigh=10, Vlow=-5, Trise=60n, Tfall=60n, Td=30n
A24 high comp_mgtt high high N016 0 N015 0 AND Vhigh=10, Vlow=-5, Trise=60n, Tfall=60n, Td=30n
A25 N012 conf_refselect_v low low ~enable_ok 0 r_mode_cc 0 OR Vhigh=10, Vlow=-5, Trise=60n, Tfall=60n, Td=30n
A26 N013 conf_refselect_v comp_uvle low ~enable_ok 0 r_mode_lvlc 0 OR Vhigh=10, Vlow=-5, Trise=60n, Tfall=60n, Td=30n
A27 N015 conf_refselect_v low comp_lvle ~enable_ok 0 r_mode_uvlc 0 OR Vhigh=10, Vlow=-5, Trise=60n, Tfall=60n, Td=30n
A3 enable_ok high high high ~mode 0 transition_ready 0 AND Vhigh=10, Vlow=-5, Trise=60n, Tfall=60n, Td=30n
A28 comp_lvle 0 0 0 0 N014 0 0 BUF Vhigh=10, Vlow=-5, Trise=60n, Tfall=60n, Td=30n
A29 comp_uvle 0 0 0 0 N016 0 0 BUF Vhigh=10, Vlow=-5, Trise=60n, Tfall=60n, Td=30n
A30 comp_lcle 0 0 0 0 N006 0 0 BUF Vhigh=10, Vlow=-5, Trise=60n, Tfall=60n, Td=30n
A31 comp_ucle 0 0 0 0 N008 0 0 BUF Vhigh=10, Vlow=-5, Trise=60n, Tfall=60n, Td=30n
.ends mode-transition

.backanno
.end